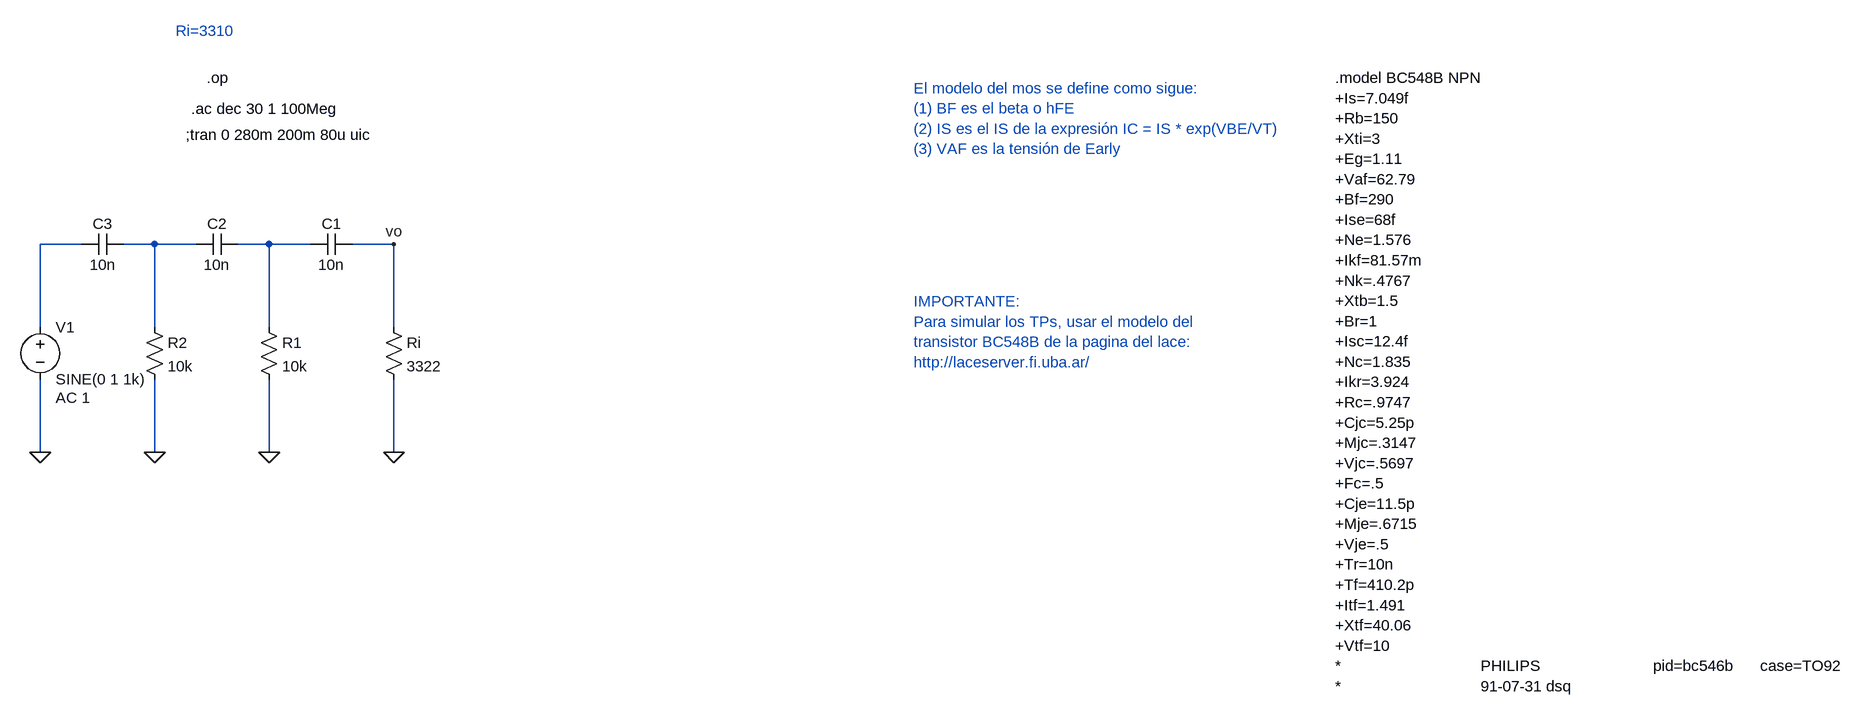
[diagram p0: schematic RC.asc]
RC.asc, the LTspice schematic file:
Version 4
SHEET 1 1900 872
WIRE -848 96 -912 96
WIRE -736 96 -784 96
WIRE -672 96 -736 96
WIRE -560 96 -608 96
WIRE -496 96 -560 96
WIRE -368 96 -432 96
WIRE -912 224 -912 96
WIRE -736 224 -736 96
WIRE -560 224 -560 96
WIRE -368 224 -368 96
WIRE -912 416 -912 304
WIRE -736 416 -736 304
WIRE -560 416 -560 304
WIRE -368 416 -368 304
FLAG -560 416 0
FLAG -736 416 0
FLAG -912 416 0
FLAG -368 416 0
FLAG -368 96 vo
SYMBOL cap -432 80 R90
WINDOW 0 0 32 VBottom 2
WINDOW 3 32 32 VTop 2
SYMATTR InstName C1
SYMATTR Value 10n
SYMBOL cap -608 80 R90
WINDOW 0 0 32 VBottom 2
WINDOW 3 32 32 VTop 2
SYMATTR InstName C2
SYMATTR Value 10n
SYMBOL cap -784 80 R90
WINDOW 0 0 32 VBottom 2
WINDOW 3 32 32 VTop 2
SYMATTR InstName C3
SYMATTR Value 10n
SYMBOL res -576 208 R0
SYMATTR InstName R1
SYMATTR Value 10k
SYMBOL res -752 208 R0
SYMATTR InstName R2
SYMATTR Value 10k
SYMBOL voltage -912 208 R0
WINDOW 123 24 124 Left 2
WINDOW 39 0 0 Left 0
SYMATTR InstName V1
SYMATTR Value SINE(0 1 1k)
SYMATTR Value2 AC 1
SYMBOL res -384 208 R0
SYMATTR InstName Ri
SYMATTR Value 3322
TEXT 1080 -160 Left 2 !.model BC548B NPN\n+Is=7.049f\n+Rb=150\n+Xti=3\n+Eg=1.11\n+Vaf=62.79\n+Bf=290\n+Ise=68f\n+Ne=1.576\n+Ikf=81.57m\n+Nk=.4767\n+Xtb=1.5\n+Br=1\n+Isc=12.4f\n+Nc=1.835\n+Ikr=3.924\n+Rc=.9747\n+Cjc=5.25p\n+Mjc=.3147\n+Vjc=.5697\n+Fc=.5\n+Cje=11.5p\n+Mje=.6715\n+Vje=.5\n+Tr=10n\n+Tf=410.2p\n+Itf=1.491\n+Xtf=40.06\n+Vtf=10\n*                               PHILIPS                         pid=bc546b      case=TO92\n*                               91-07-31 dsq
TEXT 432 -144 Left 2 ;El modelo del mos se define como sigue:\n(1) BF es el beta o hFE\n(2) IS es el IS de la expresión IC = IS * exp(VBE/VT)\n(3) VAF es la tensión de Early
TEXT 432 184 Left 2 ;IMPORTANTE:\nPara simular los TPs, usar el modelo del \ntransistor BC548B de la pagina del lace:\nhttp://laceserver.fi.uba.ar/
TEXT -688 -72 Left 2 !;tran 0 280m 200m 80u uic
TEXT -680 -112 Left 2 !.ac dec 30 1 100Meg
TEXT -656 -160 Left 2 !.op
TEXT -704 -232 Left 2 ;Ri=3310

The netlist it stands for:
* RC.asc
C1 vo N003 10n
C2 N003 N002 10n
C3 N002 N001 10n
R1 N003 0 10k
R2 N002 0 10k
V1 N001 0 SINE(0 1 1k) AC 1
Ri vo 0 3322
.model BC548B NPN
+Is=7.049f
+Rb=150
+Xti=3
+Eg=1.11
+Vaf=62.79
+Bf=290
+Ise=68f
+Ne=1.576
+Ikf=81.57m
+Nk=.4767
+Xtb=1.5
+Br=1
+Isc=12.4f
+Nc=1.835
+Ikr=3.924
+Rc=.9747
+Cjc=5.25p
+Mjc=.3147
+Vjc=.5697
+Fc=.5
+Cje=11.5p
+Mje=.6715
+Vje=.5
+Tr=10n
+Tf=410.2p
+Itf=1.491
+Xtf=40.06
+Vtf=10
*                               PHILIPS                         pid=bc546b      case=TO92
*                               91-07-31 dsq
* El modelo del mos se define como sigue:
* (1) BF es el beta o hFE
* (2) IS es el IS de la expresión IC = IS * exp(VBE/VT)
* (3) VAF es la tensión de Early
* IMPORTANTE:
* Para simular los TPs, usar el modelo del
* transistor BC548B de la pagina del lace:
* http://laceserver.fi.uba.ar/
;tran 0 280m 200m 80u uic
.ac dec 30 1 100Meg
.op
* Ri=3310
.backanno
.end